# Altium schematic sheet Sheet2.SchDoc
size A4
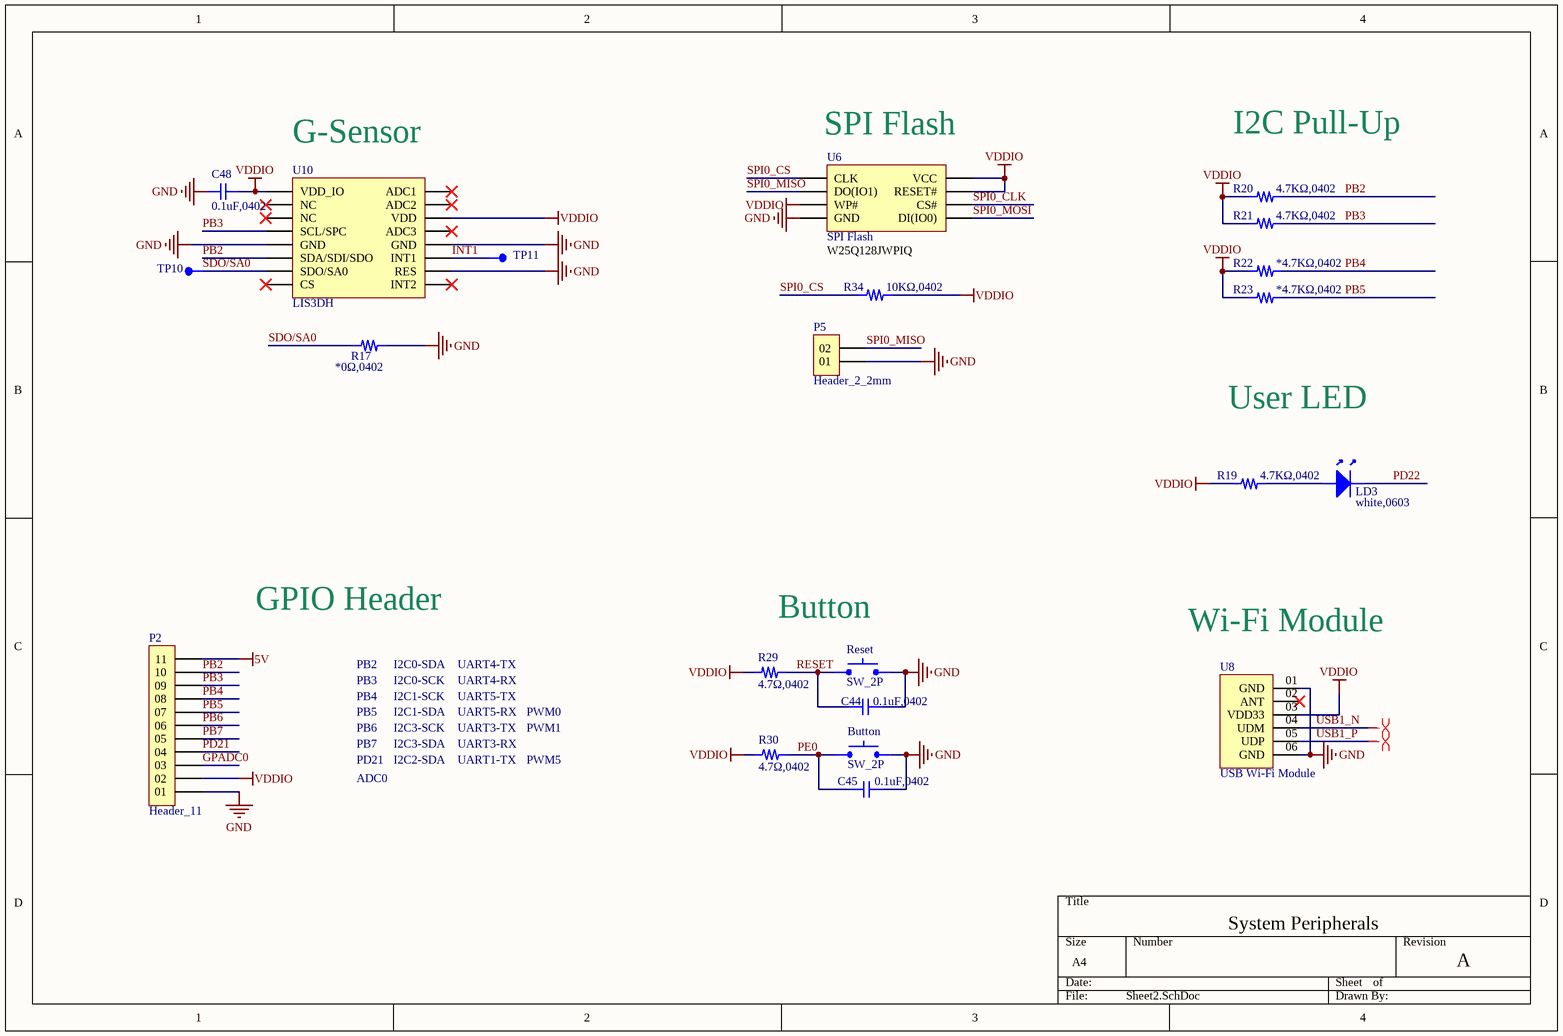
[diagram p0: Sheet2.SchDoc]

## Parts
Button  SW_2P  [SW_2P_4]
C44  0.1uF,0402  [C0402]
C45  0.1uF,0402  [C0402]
C48  0.1uF,0402  [C0402]
LD3  white,0603  [LED0603]
P2  Header_11  [Header_11]
P5  Header_2_2mm  [Header_2_2mm]
R17  *0Ω,0402  [R0402]
R19  4.7KΩ,0402  [R0402]
R20  4.7KΩ,0402  [R0402]
R21  4.7KΩ,0402  [R0402]
R22  *4.7KΩ,0402  [R0402]
R23  *4.7KΩ,0402  [R0402]
R29  4.7Ω,0402  [R0402]
R30  4.7Ω,0402  [R0402]
R34  10KΩ,0402  [R0402]
Reset  SW_2P  [SW_2P_4]
TP10  TP  [TP]  (value not drawn)
TP11  TP  [TP]  (value not drawn)
U6  SPI Flash  [WSON8]
U8  USB Wi-Fi Module  [BL-M8188FU3]
U10  LIS3DH  [LGA-16]

## Nets
5V: P2.11
GND: Button.02 C44.02 C45.02 C48.02 P2.01 P5.01 R17.02 Reset.02 U6.04(GND) U8.01(GND) U8.06(GND) U10.05(GND) U10.10(RES) U10.12(GND)
VDDIO: C48.01 P2.02 R19.02 R20.02 R21.02 R22.02 R23.02 R29.01 R30.01 R34.02 U6.03(WP#) U6.07(RESET#) U6.08(VCC) U8.03(VDD33) U10.01(VDD_IO) U10.14(VDD)
GPADC0: P2.03
INT1: TP11.01 U10.11(INT1)
PB2: P2.10 R20.01 U10.06(SDA/SDI/SDO)
PB3: P2.09 R21.01 U10.04(SCL/SPC)
PB4: P2.08 R22.01
PB5: P2.07 R23.01
PB6: P2.06
PB7: P2.05
PD21: P2.04
PD22: LD3.02
PE0: Button.01 C45.01 R30.02
RESET: C44.01 R29.02 Reset.01
SDO/SA0: R17.01 TP10.01 U10.07(SDO/SA0)
SPI0_CLK: U6.01(CS#)
SPI0_CS: R34.01 U6.06(CLK)
SPI0_MISO: P5.02 U6.02(DO(IO1))
SPI0_MOSI: U6.05(DI(IO0))
USB1_N: U8.04(UDM)
USB1_P: U8.05(UDP)
NetLD3_01: LD3.01 R19.01

Not connected (* = marked no-connect by the designer): U8 02(ANT)*; U10 02(NC)* 03(NC)* 08(CS)* 09(INT2)* 13(ADC3)* 15(ADC2)* 16(ADC1)*

## Layout directives
differential pair: USB1_N, USB1_P

## Notes on the sheet
- (near U10) G-Sensor
- (near U6) SPI Flash
- I2C Pull-Up
- W25Q128JWPIQ
- User LED
- GPIO Header
- Button
- (near U8) Wi-Fi Module
- PB2
- PB3
- PB4
- PB5
- I2C0-SDA
- I2C0-SCK
- I2C1-SCK
- I2C1-SDA
- UART4-TX
- UART4-RX
- UART5-TX
- UART5-RX
- PWM0
- PB6
- PB7
- PD21
- ADC0
- I2C3-SCK
- I2C3-SDA
- I2C2-SDA
- UART3-TX
- UART3-RX
- UART1-TX
- PWM1
- PWM5
- System Peripherals
- A

## Library data of the parts
C44 C45 C48 = Cap
LD3 = Diode - LED
P5 = Header_2
R17 R19-R23 R29 R30 R34 = Res
U8 = USB Wi-Fi Module: BL-M8188FU3 RTL8188FTV